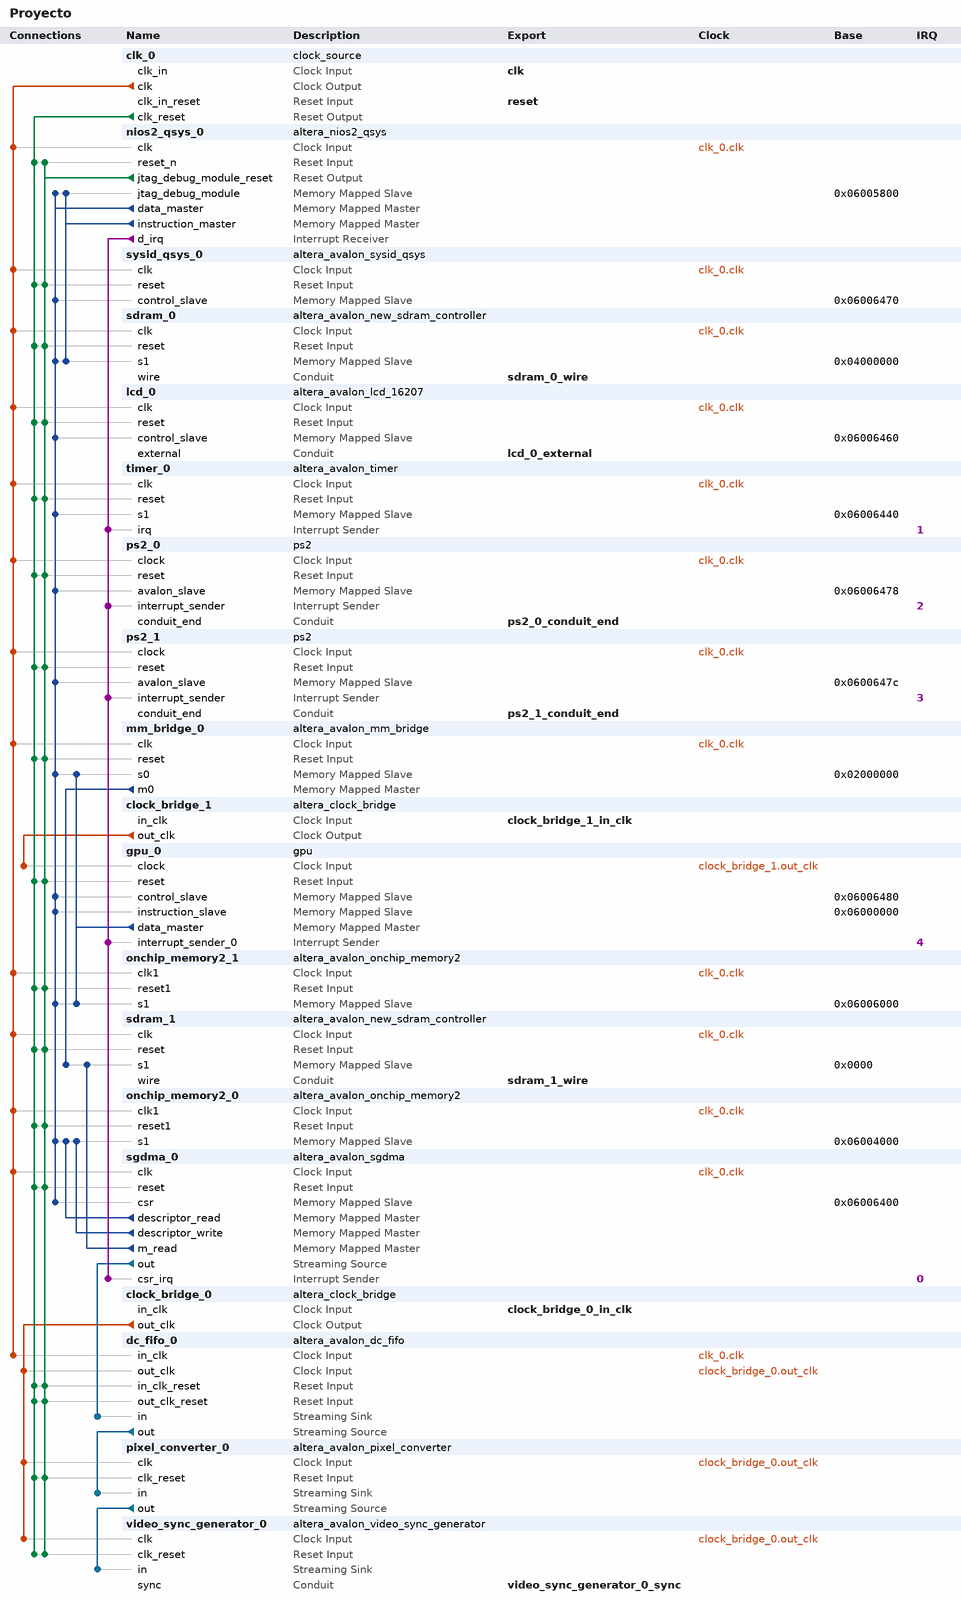
[diagram p0: system contents]
# Platform Designer (Qsys) system Proyecto
# Parameters at their usual value, and those the tool derives, are not listed.
package require -exact qsys 11.1
create_system Proyecto
set_project_property DEVICE_FAMILY CYCLONEII

add_instance clk_0 clock_source 11.1
set_instance_parameter_value clk_0 clockFrequency 100000000

add_instance nios2_qsys_0 altera_nios2_qsys 11.1
set_instance_parameter_value nios2_qsys_0 resetSlave sdram_0.s1
set_instance_parameter_value nios2_qsys_0 exceptionSlave sdram_0.s1
set_instance_parameter_value nios2_qsys_0 breakSlave nios2_qsys_0.jtag_debug_module
set_instance_parameter_value nios2_qsys_0 impl Fast
set_instance_parameter_value nios2_qsys_0 icache_size 4096

add_instance sysid_qsys_0 altera_avalon_sysid_qsys 11.1
set_instance_parameter_value sysid_qsys_0 id 911120

add_instance sdram_0 altera_avalon_new_sdram_controller 11.1
set_instance_parameter_value sdram_0 TAC 6.5
set_instance_parameter_value sdram_0 TRCD 20.0
set_instance_parameter_value sdram_0 TRFC 67.5
set_instance_parameter_value sdram_0 TRP 20.0
set_instance_parameter_value sdram_0 casLatency 2
set_instance_parameter_value sdram_0 columnWidth 9
set_instance_parameter_value sdram_0 dataWidth 16
set_instance_parameter_value sdram_0 generateSimulationModel true
set_instance_parameter_value sdram_0 initRefreshCommands 8
set_instance_parameter_value sdram_0 model custom
set_instance_parameter_value sdram_0 numberOfBanks 4
set_instance_parameter_value sdram_0 numberOfChipSelects 1
set_instance_parameter_value sdram_0 powerUpDelay 200.0
set_instance_parameter_value sdram_0 refreshPeriod 7.8125
set_instance_parameter_value sdram_0 rowWidth 13

add_instance lcd_0 altera_avalon_lcd_16207 11.1

add_instance timer_0 altera_avalon_timer 11.1
set_instance_parameter_value timer_0 alwaysRun true
set_instance_parameter_value timer_0 fixedPeriod true
set_instance_parameter_value timer_0 period 1
set_instance_parameter_value timer_0 periodUnits MSEC
set_instance_parameter_value timer_0 snapshot false
set_instance_parameter_value timer_0 timerPreset SIMPLE_PERIODIC_INTERRUPT

add_instance ps2_0 ps2 1.0
set_instance_parameter_value ps2_0 clk_frequency 100000000

add_instance ps2_1 ps2 1.0
set_instance_parameter_value ps2_1 clk_frequency 100000000

add_instance mm_bridge_0 altera_avalon_mm_bridge 11.1
set_instance_parameter_value mm_bridge_0 DATA_WIDTH 32
set_instance_parameter_value mm_bridge_0 ADDRESS_WIDTH 25
set_instance_parameter_value mm_bridge_0 ADDRESS_UNITS SYMBOLS
set_instance_parameter_value mm_bridge_0 MAX_PENDING_RESPONSES 4

add_instance clock_bridge_1 altera_clock_bridge 11.1
set_instance_parameter_value clock_bridge_1 DERIVED_CLOCK_RATE 0
set_instance_parameter_value clock_bridge_1 EXPLICIT_CLOCK_RATE 50000000

add_instance gpu_0 gpu 1.0
set_instance_parameter_value gpu_0 INSTRUCTION_SLAVE_ADDRESS_WIDTH 12

add_instance onchip_memory2_1 altera_avalon_onchip_memory2 11.1
set_instance_parameter_value onchip_memory2_1 dataWidth 32
set_instance_parameter_value onchip_memory2_1 dualPort false
set_instance_parameter_value onchip_memory2_1 initMemContent true
set_instance_parameter_value onchip_memory2_1 initializationFileName onchip_memory2_1
set_instance_parameter_value onchip_memory2_1 memorySize 1024

add_instance sdram_1 altera_avalon_new_sdram_controller 11.1
set_instance_parameter_value sdram_1 TAC 6.5
set_instance_parameter_value sdram_1 TRCD 20.0
set_instance_parameter_value sdram_1 TRFC 67.5
set_instance_parameter_value sdram_1 TRP 20.0
set_instance_parameter_value sdram_1 casLatency 2
set_instance_parameter_value sdram_1 columnWidth 9
set_instance_parameter_value sdram_1 dataWidth 16
set_instance_parameter_value sdram_1 generateSimulationModel true
set_instance_parameter_value sdram_1 initRefreshCommands 8
set_instance_parameter_value sdram_1 model custom
set_instance_parameter_value sdram_1 numberOfBanks 4
set_instance_parameter_value sdram_1 numberOfChipSelects 1
set_instance_parameter_value sdram_1 powerUpDelay 200.0
set_instance_parameter_value sdram_1 refreshPeriod 7.8125
set_instance_parameter_value sdram_1 rowWidth 13

add_instance onchip_memory2_0 altera_avalon_onchip_memory2 11.1
set_instance_parameter_value onchip_memory2_0 dataWidth 32
set_instance_parameter_value onchip_memory2_0 dualPort false
set_instance_parameter_value onchip_memory2_0 initMemContent true
set_instance_parameter_value onchip_memory2_0 initializationFileName onchip_memory2_0
set_instance_parameter_value onchip_memory2_0 memorySize 4096

add_instance sgdma_0 altera_avalon_sgdma 11.1
set_instance_parameter_value sgdma_0 enableBurstTransfers true
set_instance_parameter_value sgdma_0 enableUnalignedTransfers false
set_instance_parameter_value sgdma_0 readBlockDataWidth 32
set_instance_parameter_value sgdma_0 sinkErrorWidth 0
set_instance_parameter_value sgdma_0 sourceErrorWidth 0
set_instance_parameter_value sgdma_0 transferMode MEMORY_TO_STREAM
set_instance_parameter_value sgdma_0 writeBurstcountWidth 4

add_instance clock_bridge_0 altera_clock_bridge 11.1
set_instance_parameter_value clock_bridge_0 DERIVED_CLOCK_RATE 0
set_instance_parameter_value clock_bridge_0 EXPLICIT_CLOCK_RATE 25000000

add_instance dc_fifo_0 altera_avalon_dc_fifo 11.1
set_instance_parameter_value dc_fifo_0 SYMBOLS_PER_BEAT 4
set_instance_parameter_value dc_fifo_0 BITS_PER_SYMBOL 8
set_instance_parameter_value dc_fifo_0 FIFO_DEPTH 16
set_instance_parameter_value dc_fifo_0 USE_PACKETS 1
set_instance_parameter_value dc_fifo_0 WR_SYNC_DEPTH 2
set_instance_parameter_value dc_fifo_0 RD_SYNC_DEPTH 2

add_instance pixel_converter_0 altera_avalon_pixel_converter 11.1
set_instance_parameter_value pixel_converter_0 SOURCE_SYMBOLS_PER_BEAT 1

add_instance video_sync_generator_0 altera_avalon_video_sync_generator 11.1
set_instance_parameter_value video_sync_generator_0 DATA_STREAM_BIT_WIDTH 24
set_instance_parameter_value video_sync_generator_0 BEATS_PER_PIXEL 1
set_instance_parameter_value video_sync_generator_0 NUM_COLUMNS 640
set_instance_parameter_value video_sync_generator_0 NUM_ROWS 480
set_instance_parameter_value video_sync_generator_0 H_BLANK_PIXELS 144
set_instance_parameter_value video_sync_generator_0 H_FRONT_PORCH_PIXELS 16
set_instance_parameter_value video_sync_generator_0 H_SYNC_PULSE_PIXELS 96
set_instance_parameter_value video_sync_generator_0 H_SYNC_PULSE_POLARITY 0
set_instance_parameter_value video_sync_generator_0 V_BLANK_LINES 35
set_instance_parameter_value video_sync_generator_0 V_FRONT_PORCH_LINES 10
set_instance_parameter_value video_sync_generator_0 V_SYNC_PULSE_LINES 2
set_instance_parameter_value video_sync_generator_0 V_SYNC_PULSE_POLARITY 0
set_instance_parameter_value video_sync_generator_0 TOTAL_HSCAN_PIXELS 800
set_instance_parameter_value video_sync_generator_0 TOTAL_VSCAN_LINES 525

# connections
add_connection clk_0.clk dc_fifo_0.in_clk clock
add_connection clk_0.clk lcd_0.clk clock
add_connection clk_0.clk mm_bridge_0.clk clock
add_connection clk_0.clk nios2_qsys_0.clk clock
add_connection clk_0.clk onchip_memory2_0.clk1 clock
add_connection clk_0.clk onchip_memory2_1.clk1 clock
add_connection clk_0.clk ps2_0.clock clock
add_connection clk_0.clk ps2_1.clock clock
add_connection clk_0.clk sdram_0.clk clock
add_connection clk_0.clk sdram_1.clk clock
add_connection clk_0.clk sgdma_0.clk clock
add_connection clk_0.clk sysid_qsys_0.clk clock
add_connection clk_0.clk timer_0.clk clock
add_connection clock_bridge_0.out_clk dc_fifo_0.out_clk clock
add_connection clock_bridge_0.out_clk pixel_converter_0.clk clock
add_connection clock_bridge_0.out_clk video_sync_generator_0.clk clock
add_connection clock_bridge_1.out_clk gpu_0.clock clock
add_connection clk_0.clk_reset dc_fifo_0.in_clk_reset reset
add_connection clk_0.clk_reset dc_fifo_0.out_clk_reset reset
add_connection clk_0.clk_reset gpu_0.reset reset
add_connection clk_0.clk_reset lcd_0.reset reset
add_connection clk_0.clk_reset mm_bridge_0.reset reset
add_connection clk_0.clk_reset nios2_qsys_0.reset_n reset
add_connection clk_0.clk_reset onchip_memory2_0.reset1 reset
add_connection clk_0.clk_reset onchip_memory2_1.reset1 reset
add_connection clk_0.clk_reset pixel_converter_0.clk_reset reset
add_connection clk_0.clk_reset ps2_0.reset reset
add_connection clk_0.clk_reset ps2_1.reset reset
add_connection clk_0.clk_reset sdram_0.reset reset
add_connection clk_0.clk_reset sdram_1.reset reset
add_connection clk_0.clk_reset sgdma_0.reset reset
add_connection clk_0.clk_reset sysid_qsys_0.reset reset
add_connection clk_0.clk_reset timer_0.reset reset
add_connection clk_0.clk_reset video_sync_generator_0.clk_reset reset
add_connection nios2_qsys_0.jtag_debug_module_reset dc_fifo_0.in_clk_reset reset
add_connection nios2_qsys_0.jtag_debug_module_reset dc_fifo_0.out_clk_reset reset
add_connection nios2_qsys_0.jtag_debug_module_reset gpu_0.reset reset
add_connection nios2_qsys_0.jtag_debug_module_reset lcd_0.reset reset
add_connection nios2_qsys_0.jtag_debug_module_reset mm_bridge_0.reset reset
add_connection nios2_qsys_0.jtag_debug_module_reset nios2_qsys_0.reset_n reset
add_connection nios2_qsys_0.jtag_debug_module_reset onchip_memory2_0.reset1 reset
add_connection nios2_qsys_0.jtag_debug_module_reset onchip_memory2_1.reset1 reset
add_connection nios2_qsys_0.jtag_debug_module_reset pixel_converter_0.clk_reset reset
add_connection nios2_qsys_0.jtag_debug_module_reset ps2_0.reset reset
add_connection nios2_qsys_0.jtag_debug_module_reset ps2_1.reset reset
add_connection nios2_qsys_0.jtag_debug_module_reset sdram_0.reset reset
add_connection nios2_qsys_0.jtag_debug_module_reset sdram_1.reset reset
add_connection nios2_qsys_0.jtag_debug_module_reset sgdma_0.reset reset
add_connection nios2_qsys_0.jtag_debug_module_reset sysid_qsys_0.reset reset
add_connection nios2_qsys_0.jtag_debug_module_reset timer_0.reset reset
add_connection nios2_qsys_0.jtag_debug_module_reset video_sync_generator_0.clk_reset reset
add_connection gpu_0.data_master mm_bridge_0.s0 avalon
set_connection_parameter_value gpu_0.data_master/mm_bridge_0.s0 baseAddress 0x02000000
add_connection gpu_0.data_master onchip_memory2_1.s1 avalon
set_connection_parameter_value gpu_0.data_master/onchip_memory2_1.s1 baseAddress 0x06006000
add_connection mm_bridge_0.m0 sdram_1.s1 avalon
set_connection_parameter_value mm_bridge_0.m0/sdram_1.s1 baseAddress 0x0000
add_connection nios2_qsys_0.data_master gpu_0.control_slave avalon
set_connection_parameter_value nios2_qsys_0.data_master/gpu_0.control_slave baseAddress 0x06006480
add_connection nios2_qsys_0.data_master gpu_0.instruction_slave avalon
set_connection_parameter_value nios2_qsys_0.data_master/gpu_0.instruction_slave baseAddress 0x06000000
add_connection nios2_qsys_0.data_master lcd_0.control_slave avalon
set_connection_parameter_value nios2_qsys_0.data_master/lcd_0.control_slave baseAddress 0x06006460
add_connection nios2_qsys_0.data_master mm_bridge_0.s0 avalon
set_connection_parameter_value nios2_qsys_0.data_master/mm_bridge_0.s0 baseAddress 0x02000000
add_connection nios2_qsys_0.data_master nios2_qsys_0.jtag_debug_module avalon
set_connection_parameter_value nios2_qsys_0.data_master/nios2_qsys_0.jtag_debug_module baseAddress 0x06005800
add_connection nios2_qsys_0.data_master onchip_memory2_0.s1 avalon
set_connection_parameter_value nios2_qsys_0.data_master/onchip_memory2_0.s1 baseAddress 0x06004000
add_connection nios2_qsys_0.data_master onchip_memory2_1.s1 avalon
set_connection_parameter_value nios2_qsys_0.data_master/onchip_memory2_1.s1 baseAddress 0x06006000
add_connection nios2_qsys_0.data_master ps2_0.avalon_slave avalon
set_connection_parameter_value nios2_qsys_0.data_master/ps2_0.avalon_slave baseAddress 0x06006478
add_connection nios2_qsys_0.data_master ps2_1.avalon_slave avalon
set_connection_parameter_value nios2_qsys_0.data_master/ps2_1.avalon_slave baseAddress 0x0600647c
add_connection nios2_qsys_0.data_master sdram_0.s1 avalon
set_connection_parameter_value nios2_qsys_0.data_master/sdram_0.s1 baseAddress 0x04000000
add_connection nios2_qsys_0.data_master sgdma_0.csr avalon
set_connection_parameter_value nios2_qsys_0.data_master/sgdma_0.csr baseAddress 0x06006400
add_connection nios2_qsys_0.data_master sysid_qsys_0.control_slave avalon
set_connection_parameter_value nios2_qsys_0.data_master/sysid_qsys_0.control_slave baseAddress 0x06006470
add_connection nios2_qsys_0.data_master timer_0.s1 avalon
set_connection_parameter_value nios2_qsys_0.data_master/timer_0.s1 baseAddress 0x06006440
add_connection nios2_qsys_0.instruction_master nios2_qsys_0.jtag_debug_module avalon
set_connection_parameter_value nios2_qsys_0.instruction_master/nios2_qsys_0.jtag_debug_module baseAddress 0x06005800
add_connection nios2_qsys_0.instruction_master sdram_0.s1 avalon
set_connection_parameter_value nios2_qsys_0.instruction_master/sdram_0.s1 baseAddress 0x04000000
add_connection sgdma_0.descriptor_read onchip_memory2_0.s1 avalon
set_connection_parameter_value sgdma_0.descriptor_read/onchip_memory2_0.s1 baseAddress 0x06004000
add_connection sgdma_0.descriptor_write onchip_memory2_0.s1 avalon
set_connection_parameter_value sgdma_0.descriptor_write/onchip_memory2_0.s1 baseAddress 0x06004000
add_connection sgdma_0.m_read sdram_1.s1 avalon
set_connection_parameter_value sgdma_0.m_read/sdram_1.s1 baseAddress 0x0000
add_connection dc_fifo_0.out pixel_converter_0.in avalon_streaming
add_connection pixel_converter_0.out video_sync_generator_0.in avalon_streaming
add_connection sgdma_0.out dc_fifo_0.in avalon_streaming
add_connection nios2_qsys_0.d_irq gpu_0.interrupt_sender_0 interrupt
set_connection_parameter_value nios2_qsys_0.d_irq/gpu_0.interrupt_sender_0 irqNumber 4
add_connection nios2_qsys_0.d_irq ps2_0.interrupt_sender interrupt
set_connection_parameter_value nios2_qsys_0.d_irq/ps2_0.interrupt_sender irqNumber 2
add_connection nios2_qsys_0.d_irq ps2_1.interrupt_sender interrupt
set_connection_parameter_value nios2_qsys_0.d_irq/ps2_1.interrupt_sender irqNumber 3
add_connection nios2_qsys_0.d_irq sgdma_0.csr_irq interrupt
set_connection_parameter_value nios2_qsys_0.d_irq/sgdma_0.csr_irq irqNumber 0
add_connection nios2_qsys_0.d_irq timer_0.irq interrupt
set_connection_parameter_value nios2_qsys_0.d_irq/timer_0.irq irqNumber 1

# exported interfaces
add_interface clk clock sink
set_interface_property clk EXPORT_OF clk_0.clk_in
add_interface reset reset sink
set_interface_property reset EXPORT_OF clk_0.clk_in_reset
add_interface lcd_0_external conduit end
set_interface_property lcd_0_external EXPORT_OF lcd_0.external
add_interface sdram_0_wire conduit end
set_interface_property sdram_0_wire EXPORT_OF sdram_0.wire
add_interface sdram_1_wire conduit end
set_interface_property sdram_1_wire EXPORT_OF sdram_1.wire
add_interface clock_bridge_0_in_clk clock sink
set_interface_property clock_bridge_0_in_clk EXPORT_OF clock_bridge_0.in_clk
add_interface video_sync_generator_0_sync conduit end
set_interface_property video_sync_generator_0_sync EXPORT_OF video_sync_generator_0.sync
add_interface clock_bridge_1_in_clk clock sink
set_interface_property clock_bridge_1_in_clk EXPORT_OF clock_bridge_1.in_clk
add_interface ps2_0_conduit_end conduit end
set_interface_property ps2_0_conduit_end EXPORT_OF ps2_0.conduit_end
add_interface ps2_1_conduit_end conduit end
set_interface_property ps2_1_conduit_end EXPORT_OF ps2_1.conduit_end

save_system Proyecto.qsys
